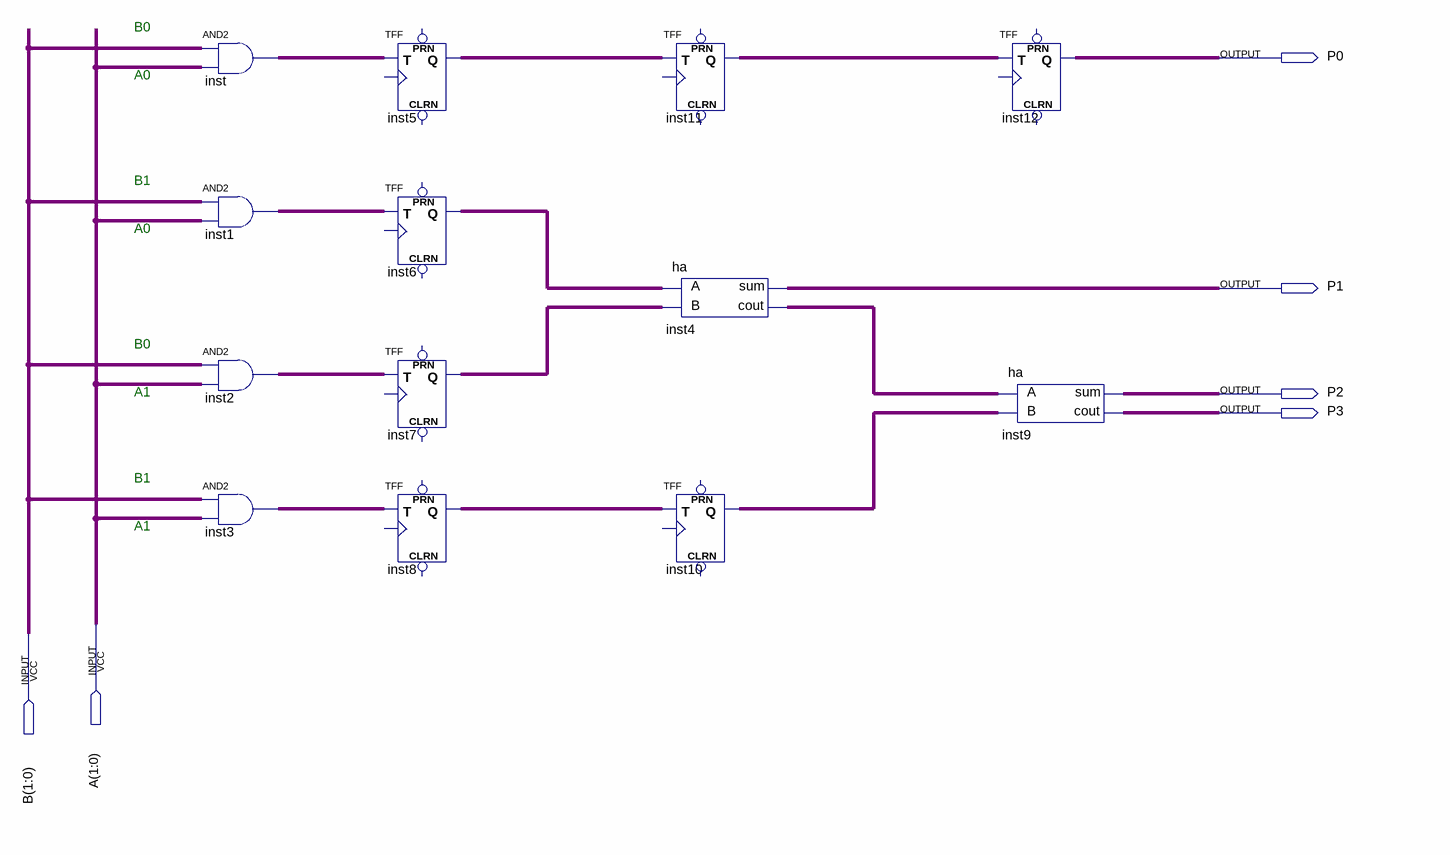
[diagram p0: schematic sheet]
// Quartus schematic schematic_2x2.bdf as structural Verilog: 13 symbols, 6 pins
module schematic_2x2 (
  input  \A(1:0) ,
  input  \B(1:0) ,
  output P0,
  output P1,
  output P2,
  output P3
);

  wire inst1_out, inst2_out, inst3_out, inst4_cout, inst5_q, inst6_q, inst7_q, inst8_q, inst10_q, inst11_q,
       inst_out;

  and inst (inst_out, \B(1:0) , \A(1:0) );
  and inst1 (inst1_out, \B(1:0) , \A(1:0) );
  and inst2 (inst2_out, \B(1:0) , \A(1:0) );
  and inst3 (inst3_out, \B(1:0) , \A(1:0) );
  TFF inst5 (.T(inst_out), .Q(inst5_q));  // open: PRN, CLRN, CLK
  TFF inst6 (.T(inst1_out), .Q(inst6_q));  // open: PRN, CLRN, CLK
  TFF inst7 (.T(inst2_out), .Q(inst7_q));  // open: PRN, CLRN, CLK
  TFF inst8 (.T(inst3_out), .Q(inst8_q));  // open: PRN, CLRN, CLK
  TFF inst11 (.T(inst5_q), .Q(inst11_q));  // open: PRN, CLRN, CLK
  ha inst4 (.A(inst6_q), .B(inst7_q), .cout(inst4_cout), .sum(P1));
  TFF inst10 (.T(inst8_q), .Q(inst10_q));  // open: PRN, CLRN, CLK
  TFF inst12 (.T(inst11_q), .Q(P0));  // open: PRN, CLRN, CLK
  ha inst9 (.A(inst4_cout), .B(inst10_q), .cout(P3), .sum(P2));

  // Notes on the sheet:
  //   B0
  //   A0
  //   B1
  //   A0
  //   B0
  //   A1
  //   B1
  //   A1
endmodule
